# EAGLE design PROGRAMMER_ARDUINO_ISP_BOARD (EAGLE 9.2.2)
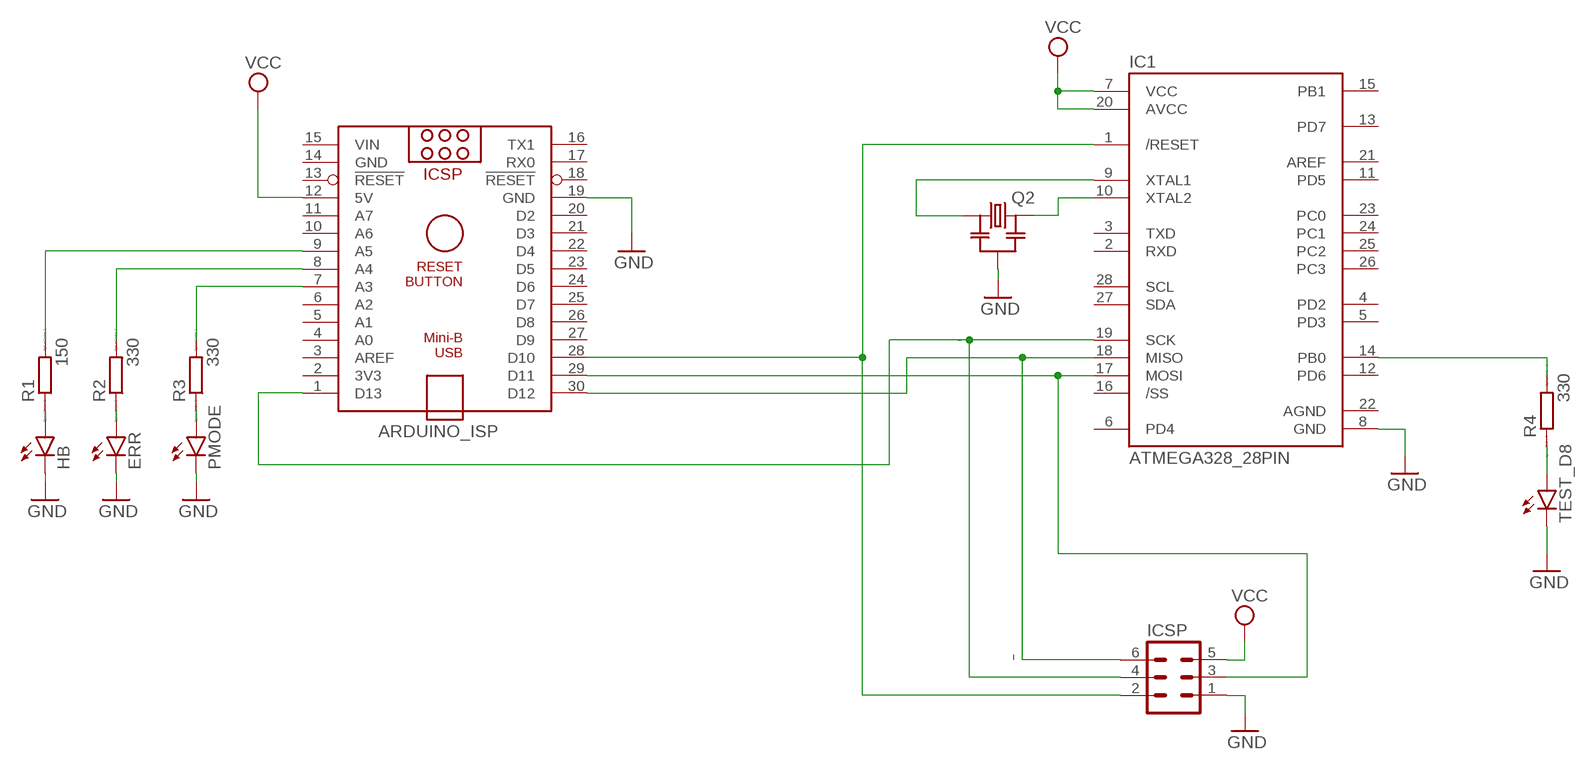
[diagram p0: schematic, sheet 1]

## Parts
ARDUINO_ISP  ARDUINO_NANO  [ARDUINO_NANO]
ERR  LED3MM  [LED3MM]
HB  LED3MM  [LED3MM]
IC1  ATMEGA328_28PIN  [DIL28-3-R]
ICSP  MA03-2  [MA03-2]
PMODE  LED3MM  [LED3MM]
Q2  RESONATOR-MURATACST_CE  [RESONATOR_MURATA2]
R1  150  R  [R0805]
R2  330  R  [R0805]
R3  330  R  [R0805]
R4  330  R  [R0805]
TEST_D8  330  LED3MM  [LED3MM]

## Nets
GND: ARDUINO_ISP.19(GND) ERR.K(C) HB.K(C) IC1.8(GND) ICSP.1 PMODE.K(C) Q2.2 TEST_D8.K(C)
N$1: IC1.9(XTAL1) Q2.1
N$2: IC1.10(XTAL2) Q2.3
N$3: ARDUINO_ISP.29(D11) IC1.17(MOSI) ICSP.3
N$4: ARDUINO_ISP.30(D12) IC1.18(MISO) ICSP.6
N$7: HB.A R1.1
N$8: R4.1 TEST_D8.A
N$9: ERR.A R2.1
N$10: PMODE.A R3.1
N$11: ARDUINO_ISP.7(A3) R3.2
N$12: ARDUINO_ISP.8(A4) R2.2
N$13: ARDUINO_ISP.9(A5) R1.2
N$14: IC1.14(PB0) R4.2
N$17: ARDUINO_ISP.28(D10) IC1.1(/RESET) ICSP.2
N$18: ARDUINO_ISP.1(D13) IC1.19(SCK) ICSP.4
VCC: ARDUINO_ISP.12(5V) IC1.7(VCC) IC1.20(AVCC) ICSP.5
Unconnected: ARDUINO_ISP.2(3V3) ARDUINO_ISP.3(AREF) ARDUINO_ISP.4(A0) ARDUINO_ISP.5(A1) ARDUINO_ISP.6(A2) ARDUINO_ISP.10(A6) ARDUINO_ISP.11(A7) ARDUINO_ISP.13(!RESET) ARDUINO_ISP.16(TX1) ARDUINO_ISP.17(RX0) ARDUINO_ISP.18(!RESET) ARDUINO_ISP.20(D2) ARDUINO_ISP.21(D3) ARDUINO_ISP.22(D4) ARDUINO_ISP.23(D5) ARDUINO_ISP.24(D6) ARDUINO_ISP.25(D7) ARDUINO_ISP.26(D8) ARDUINO_ISP.27(D9) IC1.2(RXD) IC1.3(TXD) IC1.4(PD2) IC1.5(PD3) IC1.6(PD4) IC1.11(PD5) IC1.12(PD6) IC1.13(PD7) IC1.15(PB1) IC1.16(/SS) IC1.21(AREF) IC1.23(PC0) IC1.24(PC1) IC1.25(PC2) IC1.26(PC3) IC1.27(SDA) IC1.28(SCL)

## Power pins joined to a net without a drawn wire
AGND: IC1.22(AGND)
GND: ARDUINO_ISP.14(GND)
VIN: ARDUINO_ISP.15(VIN)

## Library data of the parts
ARDUINO_ISP = ArduinoNanoV30:ARDUINO_NANO: Arduino Nano V3.0 Overview: The Arduino Nano is a small, complete, and breadboard-friendly board based on the ATmega328 (Arduino Nano 3.x) or ATmega168 (Arduino Nano 2.x). It has more or less the same functionality of the Arduino Duemilanove, but in a different package. It lacks only a DC power jack, and works with a Mini-B USB cable instead of a standard one. The Nano was designed and is being produced by Gravitech. Specifications: Microcontroller Atmel ATmega168 or ATmega328 Operating Voltage (logic level) 5 V Input Voltage (recommended) 7-12 V Input Voltage (limits) 6-20 V Digital I/O Pins 14 (of which 6 provide PWM output) Analog Input Pins 8 DC Current per I/O Pin 40 mA Flash Memory 16 KB (ATmega168) or 32 KB (ATmega328) of which 2 KB used by bootloader SRAM 1 KB (ATmega168) or 2 KB (ATmega328) EEPROM 512 bytes (ATmega168) or 1 KB (ATmega328) Clock Speed 16 MHz Dimensions 0.73" x 1.70" Length 45 mm Width 18 mm Weigth 5 g Power: The Arduino Nano can be powered via the Mini-B USB connection, 6-20V unregulated external power supply (pin 30), or 5V regulated external power supply (pin 27). The power source is automatically selected to the highest voltage source. Memory: The ATmega168 has 16 KB of flash memory for storing code (of which 2 KB is used for the bootloader); the ATmega328 has 32 KB, (also with 2 KB used for the bootloader). The ATmega168 has 1 KB of SRAM and 512 bytes of EEPROM (which can be read and written with the EEPROM library); the ATmega328 has 2 KB of SRAM and 1 KB of EEPROM. Input and Output: Each of the 14 digital pins on the Nano can be used as an input or output, using pinMode(), digitalWrite(), and digitalRead() functions. They operate at 5 volts. Each pin can provide or receive a maximum of 40 mA and has an internal pull-up resistor (disconnected by default) of 20-50 kOhms. In addition, some pins have specialized functions. Visit Arduino - ArduinoBoardNano <https://www.arduino.cc/en/Main/ArduinoBoardNano>
ERR HB PMODE TEST_D8 = led_3mm:LED: LED OSRAM: - CHIPLED LG R971, LG N971, LY N971, LG Q971, LY Q971, LO R971, LY R971 LH N974, LH R974 LS Q976, LO Q976, LY Q976 LO Q996 - Hyper CHIPLED LW Q18S LB Q993, LB Q99A, LB R99A - SideLED LS A670, LO A670, LY A670, LG A670, LP A670 LB A673, LV A673, LT A673, LW A673 LH A674 LY A675 LS A676, LA A676, LO A676, LY A676, LW A676 LS A679, LY A679, LG A679 - Hyper Micro SIDELED® LS Y876, LA Y876, LO Y876, LY Y876 LT Y87S - SmartLED LW L88C, LW L88S LB L89C, LB L89S, LG L890 LS L89K, LO L89K, LY L89K LS L896, LA L896, LO L896, LY L896 - TOPLED LS T670, LO T670, LY T670, LG T670, LP T670 LSG T670, LSP T670, LSY T670, LOP T670, LYG T670 LG T671, LOG T671, LSG T671 LB T673, LV T673, LT T673, LW T673 LH T674 LS T676, LA T676, LO T676, LY T676, LB T676, LH T676, LSB T676, LW T676 LB T67C, LV T67C, LT T67C, LS T67K, LO T67K, LY T67K, LW E67C LS E67B, LA E67B, LO E67B, LY E67B, LB E67C, LV E67C, LT E67C LW T67C LS T679, LY T679, LG T679 LS T770, LO T770, LY T770, LG T770, LP T770 LB T773, LV T773, LT T773, LW T773 LH T774 LS E675, LA E675, LY E675, LS T675 LS T776, LA T776, LO T776, LY T776, LB T776 LHGB T686 LT T68C, LB T68C - Hyper Mini TOPLED® LB M676 - Mini TOPLED Santana® LG M470 LS M47K, LO M47K, LY M47K Source: http://www.osram.convergy.de LUXEON: - LUMILED® LXK2-PW12-R00, LXK2-PW12-S00, LXK2-PW14-U00, LXK2-PW14-V00 LXK2-PM12-R00, LXK2-PM12-S00, LXK2-PM14-U00 LXK2-PE12-Q00, LXK2-PE12-R00, LXK2-PE12-S00, LXK2-PE14-T00, LXK2-PE14-U00 LXK2-PB12-K00, LXK2-PB12-L00, LXK2-PB12-M00, LXK2-PB14-N00, LXK2-PB14-P00, LXK2-PB14-Q00 LXK2-PR12-L00, LXK2-PR12-M00, LXK2-PR14-Q00, LXK2-PR14-R00 LXK2-PD12-Q00, LXK2-PD12-R00, LXK2-PD12-S00 LXK2-PH12-R00, LXK2-PH12-S00 LXK2-PL12-P00, LXK2-PL12-Q00, LXK2-PL12-R00 Source: www.luxeon.com KINGBRIGHT: KA-3528ASYC Source: www.kingbright.com
IC1 = aquest:ATMEGA328_28PIN: DIP 28 pin package
ICSP = con-lstb_mod:MA03-2: PIN HEADER; OC_FARNELL: unknown; OC_NEWARK: unknown
Q2 = m-pad-2.1:RESONATOR-MURATA: Murata ceramic Resonator "ceralock" CSTCE series with built in load capacitance +- 0.5% tolerance 12.51MHz to 19.99MHz 16MHz murata part#: CSTCE16M0V53-R0 16MHz digikey part#: 490-1198-1-ND $1.33 each
R1-R4 = eagle-ltspice:R: RESISTOR, European symbol; SPICEMODEL: NONE; SPICEPREFIX: R

## Board
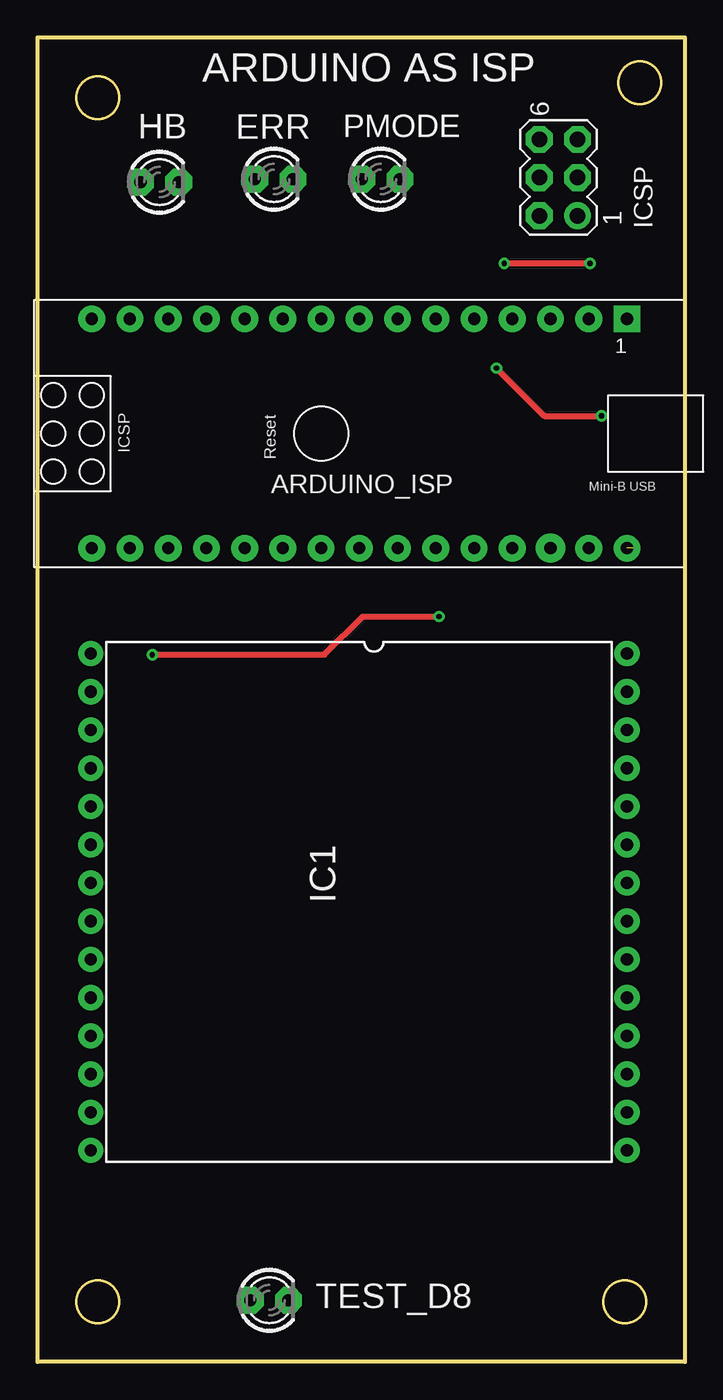
[diagram p1: board, top side]
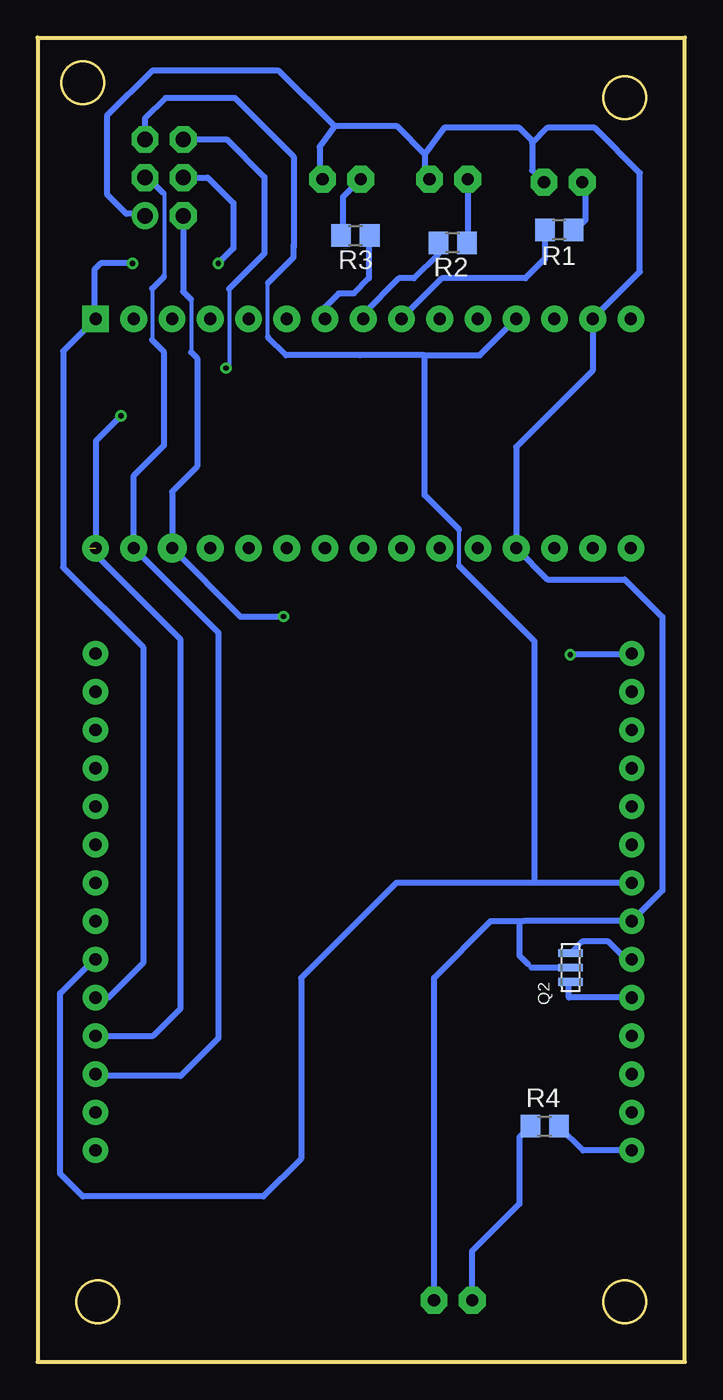
[diagram p2: board, bottom side, seen from below]

Size 43 x 88 mm. Coordinates in mm from the lower left corner, seen from the top.
Outline: 43,88 0,88 0,0 43,0 43,88
Outline: circle at 4,84 radius 1.41
Outline: circle at 40,85 radius 1.41
Outline: circle at 4,4 radius 1.41
Outline: circle at 39,4 radius 1.41
Copper layers (1*16): Top 0.035mm / dielectric 1.5mm / Bottom 0.035mm
Design rules "default": minimum track width 6mil, minimum drill 0.35mm, track to track 6mil, track to pad 6mil, pad to pad 6mil, via to via 6mil, smd to smd 6mil, copper to edge 40mil, drill to drill 6mil, minimum pad ring 10mil, minimum via ring 8mil, stop-mask expansion 4mil, vias tented up to drill 0mil, thermal gap 10mil

### Footprints (pad centres in the part's own frame; a part is rotated, then mirrored left to right if it is on the bottom)
ARDUINO_NANO = drill 0.8 pad 1.778 square: 1 -20.32,-7.62 | drill 0.8 pad 1.778: 2 -17.78,-7.62; 3 -15.24,-7.62; 4 -12.7,-7.62; 5 -10.16,-7.62; 6 -7.62,-7.62; 7 -5.08,-7.62; 8 -2.54,-7.62; 9 0,-7.62; 10 2.54,-7.62; 11 5.08,-7.62; 12 7.62,-7.62; 13 10.16,-7.62; 14 12.7,-7.62; 15 15.24,-7.62; 16 15.24,7.62; 17 12.7,7.62; 18 10.16,7.62; 19 7.62,7.62; 20 5.08,7.62; 21 2.54,7.62; 22 0,7.62; 23 -2.54,7.62; 24 -5.08,7.62; 25 -7.62,7.62; 26 -10.16,7.62; 27 -12.7,7.62; 29 -17.78,7.62; 30 -20.32,7.62 | drill 0.8 pad 1.93: 28 -15.24,7.62
LED3MM = drill 0.813 pad 1.778 octagon: A -1.27,0; K 1.27,0
DIL28-3-R = drill 0.813 pad 1.676: 1 -16.51,-25.81; 2 -13.97,-25.81; 3 -11.43,-25.81; 4 -8.89,-25.81; 5 -6.35,-25.81; 6 -3.81,-25.81; 7 -1.27,-25.81; 8 1.27,-25.81; 9 3.81,-25.81; 10 6.35,-25.81; 11 8.89,-25.81; 12 11.43,-25.81; 13 13.97,-25.81; 14 16.51,-25.81; 15 16.51,9.81; 16 13.97,9.81; 17 11.43,9.81; 18 8.89,9.81; 19 6.35,9.81; 20 3.81,9.81; 21 1.27,9.81; 22 -1.27,9.81; 23 -3.81,9.81; 24 -6.35,9.81; 25 -8.89,9.81; 26 -11.43,9.81; 27 -13.97,9.81; 28 -16.51,9.81
MA03-2 = drill 1.016 pad 1.778: 1 -2.54,-1.27 | drill 1.016 pad 1.778 octagon: 2 -2.54,1.27; 3 0,-1.27; 4 0,1.27; 5 2.54,-1.27; 6 2.54,1.27
RESONATOR_MURATA2 = smd 0.5 x 1.6: 1 -0.95,0; 2 0,0; 3 0.95,0
R0805 = smd 1.3 x 1.5: 1 -0.95,0; 2 0.95,0

### Placement (x,y rotation side)
ARDUINO_ISP  18.83,61.69 180 top
ERR  15.7,78.6 0 top
HB  8.1,78.4 0 top
IC1  29.34,30.56 270 top
ICSP  34.6,78.7 90 top
PMODE  22.8,78.6 0 top
Q2  7.6,26.2 270 bottom
R1  8.35,75.23 180 bottom
R2  15.43,74.37 180 bottom
R3  21.89,74.85 0 bottom
R4  9.32,15.66 0 bottom
TEST_D8  15.4,4.1 0 top

### Tracks (layer width: path | path; a pad name or v marks a point on that pad's centre or on a via)
GND  (1 unrouted)
  Bottom 0.152: 10.71,29.29 11,29 | 10.16,81 10.16,81.16 | 10.41,26.41 10.2,26.2
  Bottom 0.406: 11,29 11,27 10.41,26.41 | 10.16,81.16 11,82 16,82 17.27,80.27 | 17.27,80.27 19.1,82.1 23.28,82.1 26.98,85.8 35.4,85.8 38.4,82.8 38.4,77.6 37.1,76.3 36.01,76.3 ICSP.1 | 23.27,82.1 24.27,80.74 24.27,78.8 PMODE.K | HB.K 10.16,79.19 10.16,81 9.16,82 6,82 3,79 3,72.44 ARDUINO_ISP.14 6.13,65.87 11.21,60.79 ARDUINO_ISP.19 9.14,52 4,52 1.5,49.5 1.5,31.32 IC1.8 10.71,29.29 12.91,29.29 16.67,25.53 TEST_D8.K | 17.27,80.27 17.27,78.9 ERR.K | 10.2,26.2 Q2.2
N$1
  Bottom 0.152: IC1.9 3.89,26.75
  Bottom 0.406: 3.89,26.75 5.08,27.94 6.81,27.94 Q2.1
N$2
  Bottom 0.152: 7.71,25.14 Q2.3
  Bottom 0.406: IC1.10 7.71,24.21 7.71,25.14
N$3
  Bottom 0.152: 36.61,53.39 ARDUINO_ISP.29 | 34.6,77.7 34.7,77.7 | 39.02,19 IC1.17
  Bottom 0.254: 34.6,77.7 34.6,72.13 | 35.4,71.33 35.4,67.9
  Bottom 0.406: 34.6,72.13 35.4,71.33 | 39.02,19 33.5,19 31,21.5 31,48.46 ARDUINO_ISP.29 36.61,58.9 34.6,60.91 34.6,67.1 35.4,67.9 | 34.7,77.7 35.7,78.7 ICSP.3
N$4  (via drill 0.35)  (1 unrouted)
  Top 0.406: v30.48,66.04 33.66,62.87 v37.47,62.87
  Bottom 0.152: 30.29,66.23 v30.48,66.04
  Bottom 0.254: 30.29,71.31 30.29,66.23
  Bottom 0.406: IC1.18 35.33,21.67 33.5,23.5 33.5,48 39.58,54.08 | ARDUINO_ISP.30 39.15,54.05 39.11,54.01 39.11,60.7 39.11,61.22 v37.47,62.87 | ICSP.6 30.44,81.24 27.94,78.74 27.94,73.66 30.29,71.31
N$7
  Bottom 0.152: 7.62,75.45 R1.1
  Bottom 0.406: R1.1 7.27,75.23 6.6,75.9 6.6,78.17 HB.A
N$8
  Bottom 0.406: R4.1 11,14.93 11,10.5 14.13,7.37 TEST_D8.A
N$9
  Bottom 0.406: ERR.A 14.43,74.42 R2.1
N$10
  Bottom 0.406: R3.1 22.7,74.99 22.7,77.43 PMODE.A
N$11
  Bottom 0.152: R3.2 21,74.79
  Bottom 0.406: 21,74.79 21,72 22,71 23,71 23.91,70.09 ARDUINO_ISP.7
N$12
  Bottom 0.152: R2.2 16.38,73.62 | 21.37,69.63 ARDUINO_ISP.8
  Bottom 0.406: 21.37,69.63 19,72 18,72 16.38,73.62
N$13
  Bottom 0.406: R1.2 9.3,73.3 10.6,72 16.14,72 ARDUINO_ISP.9
N$14
  Bottom 0.406: IC1.14 6.76,14.05 R4.2
N$17  (via drill 0.35)
  Top 0.406: v7.62,46.99 19.05,46.99 21.59,49.53 v26.67,49.53
  Bottom 0.152: IC1.1 3.61,46.99
  Bottom 0.254: 32.8,70.6 32.8,67.1
  Bottom 0.406: 32.8,67.1 32.4,66.7 32.4,59.5 34.07,57.83 ARDUINO_ISP.28 29.53,49.53 v26.67,49.53 | ICSP.2 33.33,71.13 32.8,70.6 | 3.61,46.99 v7.62,46.99
N$18  (via drill 0.35)
  Top 0.406: v31,73 v36.7,73
  Bottom 0.152: 38.29,24.21 IC1.19 | ARDUINO_ISP.1 39.23,69.23
  Bottom 0.406: 38.29,24.21 36,26.5 36,47.5 41.3,52.8 41.3,67.16 39.23,69.23 39.23,72.58 38.81,73 v36.7,73 | ICSP.4 31.7,78.7 30,77 30,74 v31,73
VCC
  Bottom 0.152: 3.17,31.83 IC1.7 | 39.25,26.75 IC1.20
  Bottom 0.254: 15,52.9 15,55.3 | 27.7,68.1 27.7,71.7
  Bottom 0.406: IC1.7 10,31.83 | 10,31.83 19.17,31.83 25.5,25.5 25.5,13.5 28,11 40,11 41.5,12.5 41.5,24.5 39.25,26.75 | 26,74.2 26,80.1 29.9,84 34.5,84 35.87,82.63 ICSP.5 | 26,74.2 26,74 | ARDUINO_ISP.12 13.62,66.9 17.3,66.9 | 17.3,66.9 21.6,66.9 26.5,66.9 27.7,68.1 | 15,52.9 10,47.9 10,31.83 | 15,55.3 17.3,57.6 17.3,66.9 | 26,74.2 26,73.4 27.7,71.7

### Text on the board
tNames: ARDUINO AS ISP